# Altium schematic sheet TFillNoise.schDoc
size A3; Organization: Altium Limited; Address1: L3, 12a Rodborough Rd; Address2: Frenchs Forest; Address3: NSW; Address4: Australia 2086; DocumentNumber: 11; SheetNumber: 11; SheetTotal: 22
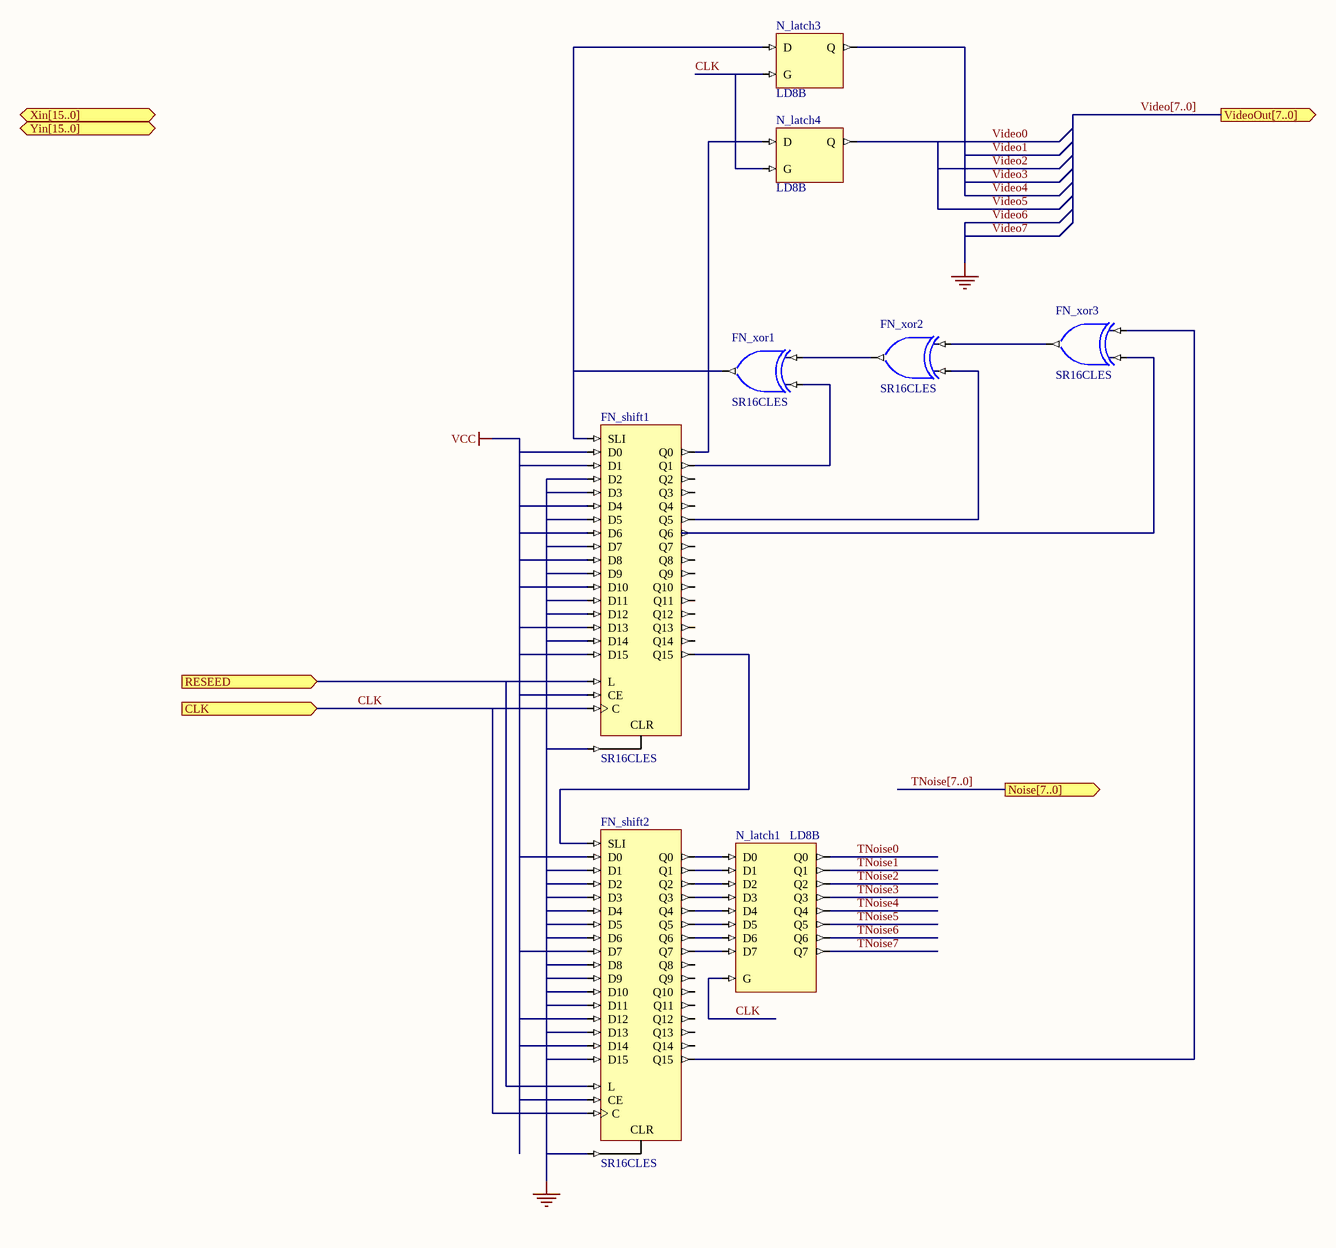
[diagram p0: TFillNoise.schDoc]

## Parts
FN_shift1  SR16CLES
FN_shift2  SR16CLES
FN_xor1  SR16CLES
FN_xor2  SR16CLES
FN_xor3  SR16CLES
N_latch1  LD8B
N_latch3  LD8B
N_latch4  LD8B

## Ports
CLK (in), Noise[7..0] (out), RESEED (in), VideoOut[7..0] (out), Xin[15..0] (in), Yin[15..0] (in)

## Nets
VCC: FN_shift1.CE FN_shift1.D0 FN_shift1.D1 FN_shift1.D4 FN_shift1.D6 FN_shift1.D8 FN_shift1.D10 FN_shift1.D13 FN_shift1.D15 FN_shift2.CE FN_shift2.D0 FN_shift2.D7 FN_shift2.D12 FN_shift2.D14
Video6: FN_shift1.CLR FN_shift1.D2 FN_shift1.D3 FN_shift1.D5 FN_shift1.D7 FN_shift1.D9 FN_shift1.D11 FN_shift1.D12 FN_shift1.D14 FN_shift2.CLR FN_shift2.D1 FN_shift2.D2 FN_shift2.D3 FN_shift2.D4 FN_shift2.D5 FN_shift2.D6 FN_shift2.D8 FN_shift2.D9 FN_shift2.D10 FN_shift2.D11 FN_shift2.D13 FN_shift2.D15  [also labelled GND, Video7]
CLK: FN_shift1.C FN_shift2.C N_latch1.G N_latch3.G N_latch4.G ; port CLK
RESEED: FN_shift1.L FN_shift2.L ; port RESEED
TNoise0: N_latch1.Q0
TNoise1: N_latch1.Q1
TNoise2: N_latch1.Q2
TNoise3: N_latch1.Q3
TNoise4: N_latch1.Q4
TNoise5: N_latch1.Q5
TNoise6: N_latch1.Q6
TNoise7: N_latch1.Q7
Video0: N_latch4.Q  [also labelled Video2, Video5]
Video1: N_latch3.Q  [also labelled Video3, Video4]
NetFN_shift1_Q0: FN_shift1.Q0 N_latch4.D
NetFN_shift1_Q1: FN_shift1.Q1 FN_xor1.I0
NetFN_shift1_Q5: FN_shift1.Q5 FN_xor2.I0
NetFN_shift1_Q6: FN_shift1.Q6 FN_xor3.I0
NetFN_shift1_Q15: FN_shift1.Q15 FN_shift2.SLI
NetFN_shift1_SLI: FN_shift1.SLI FN_xor1.O N_latch3.D
NetFN_shift2_Q0: FN_shift2.Q0 N_latch1.D0
NetFN_shift2_Q1: FN_shift2.Q1 N_latch1.D1
NetFN_shift2_Q2: FN_shift2.Q2 N_latch1.D2
NetFN_shift2_Q3: FN_shift2.Q3 N_latch1.D3
NetFN_shift2_Q4: FN_shift2.Q4 N_latch1.D4
NetFN_shift2_Q5: FN_shift2.Q5 N_latch1.D5
NetFN_shift2_Q6: FN_shift2.Q6 N_latch1.D6
NetFN_shift2_Q7: FN_shift2.Q7 N_latch1.D7
NetFN_shift2_Q15: FN_shift2.Q15 FN_xor3.I1
NetFN_xor1_I1: FN_xor1.I1 FN_xor2.O
NetFN_xor2_I1: FN_xor2.I1 FN_xor3.O

Not connected (* = marked no-connect by the designer): FN_shift1 Q2 Q3 Q4 Q7 Q8 Q9 Q10 Q11 Q12 Q13 Q14; FN_shift2 Q8 Q9 Q10 Q11 Q12 Q13 Q14

## Buses and harness runs
bus TNoise[7..0] = port Noise[7..0]
bus Video[7..0] = port VideoOut[7..0]

## Notes on the sheet
- Title
- Size:
- Date:
- A3
- Number:
- Time:
- Revision:
- Sheet
- of
- File:

## Library data of the parts
FN_shift1 FN_shift2 = SR16CLES: 16-Bit Loadable Serial/Parallel-In Parallel-Out Shift Registers with Clock Enable and Asynchronous Clear, Single Pin Version; ArchiveName: GENERIC; Published: 9-30-2003; Publisher: Altium Limited; Core Revision: 1.00.00
FN_xor1-FN_xor3 = XOR2S: 2-Input Exclusive-OR Gate, Single Pin Version; Xilinx Equivalent: XOR2; ArchiveName: GENERIC; Published: 9-30-2003; Publisher: Altium Limited; Core Revision: 1.00.00
N_latch1 = LD8S: 8-Bit Transparent Data Latch, Single Pin Version; ArchiveName: GENERIC; Published: 9-30-2003; Publisher: Altium Limited; Core Revision: 1.00.00
N_latch3 N_latch4 = LD: Transparent Data Latch; ArchiveName: GENERIC; Published: 9-30-2003; Publisher: Altium Limited; Xilinx Equivalent: LD; Core Revision: 1.00.00